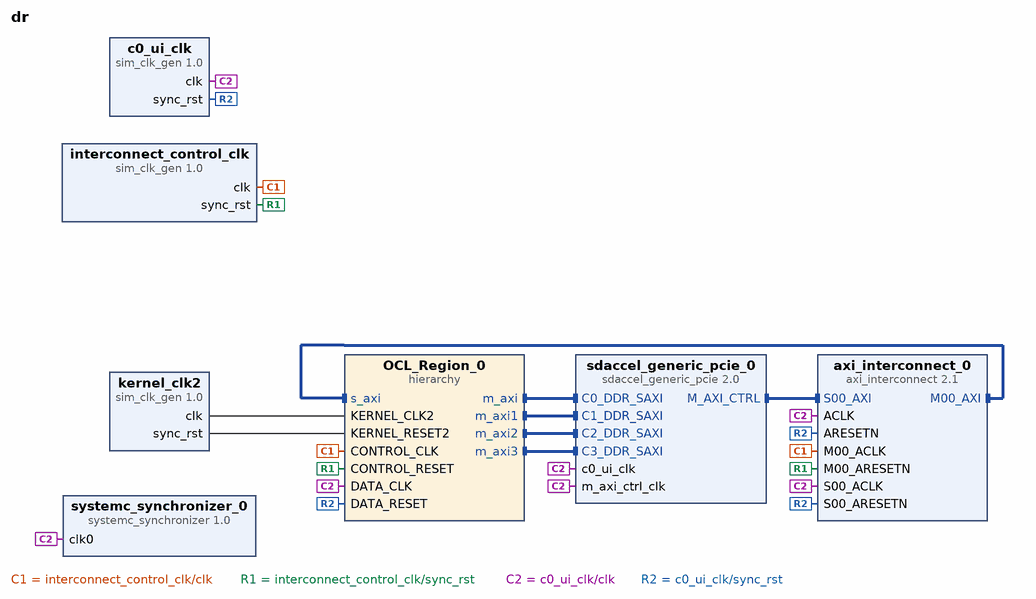
[diagram p0: block diagram of the top level]
# Vivado block design dr, xcvu9p-flgb2104-2-i, Vivado 2017.1_sdxop
create_bd_design dr

create_bd_cell -type hier OCL_Region_0
create_bd_cell -type ip -vlnv xilinx.com:ip:sdaccel_generic_pcie:2.0 sdaccel_generic_pcie_0
set_property -dict [list \
  CONFIG.NUM_SLAVE_SLOTS 4 \
  CONFIG.ADDR_RANGES 1 \
  CONFIG.S0_ADDR_WIDTH 36 \
  CONFIG.S0_DATA_WIDTH 512 \
  CONFIG.S1_ADDR_WIDTH 36 \
  CONFIG.S1_DATA_WIDTH 512 \
  CONFIG.S2_ADDR_WIDTH 36 \
  CONFIG.S2_DATA_WIDTH 512 \
  CONFIG.S3_ADDR_WIDTH 36 \
  CONFIG.S3_DATA_WIDTH 512 \
  CONFIG.C0.NAME mem0 \
  CONFIG.C0.TYPE ddr4 \
  CONFIG.C0.SIZE 16GB \
  CONFIG.C0.A00_BASE_ADDR 0x0000000000000000 \
  CONFIG.C0.A00_HIGH_ADDR 0x0000000400000000 \
  CONFIG.C1.NAME mem1 \
  CONFIG.C1.TYPE ddr4 \
  CONFIG.C1.SIZE 16GB \
  CONFIG.C1.A00_BASE_ADDR 0x0000000400000000 \
  CONFIG.C1.A00_HIGH_ADDR 0x0000000400000000 \
  CONFIG.C2.NAME mem2 \
  CONFIG.C2.TYPE ddr4 \
  CONFIG.C2.SIZE 16GB \
  CONFIG.C2.A00_BASE_ADDR 0x0000000800000000 \
  CONFIG.C2.A00_HIGH_ADDR 0x0000000400000000 \
  CONFIG.NUMBER_OF_GLOBAL_MEMORIES 4 \
  CONFIG.C3.NAME mem3 \
  CONFIG.C3.TYPE ddr4 \
  CONFIG.C3.SIZE 16GB \
  CONFIG.C3.A00_BASE_ADDR 0x0000000C00000000 \
  CONFIG.C3.A00_HIGH_ADDR 0x0000000400000000 \
] [get_bd_cells sdaccel_generic_pcie_0]
create_bd_cell -type ip -vlnv xilinx.com:ip:systemc_synchronizer:1.0 systemc_synchronizer_0
set_property -dict {CONFIG.NUM_OF_CLOCKS 1} [get_bd_cells systemc_synchronizer_0]
create_bd_cell -type ip -vlnv xilinx.com:ip:sim_clk_gen:1.0 c0_ui_clk
set_property -dict {CONFIG.INITIAL_RESET_CLOCK_CYCLES 5 CONFIG.FREQ_HZ 250000000} [get_bd_cells c0_ui_clk]
create_bd_cell -type ip -vlnv xilinx.com:ip:sim_clk_gen:1.0 interconnect_control_clk
set_property -dict {CONFIG.INITIAL_RESET_CLOCK_CYCLES 5 CONFIG.FREQ_HZ 125000000} [get_bd_cells interconnect_control_clk]
create_bd_cell -type ip -vlnv xilinx.com:ip:axi_interconnect:2.1 axi_interconnect_0
set_property -dict {CONFIG.NUM_MI 1} [get_bd_cells axi_interconnect_0]
create_bd_cell -type ip -vlnv xilinx.com:ip:sim_clk_gen:1.0 kernel_clk2
set_property -dict {CONFIG.INITIAL_RESET_CLOCK_CYCLES 5 CONFIG.FREQ_HZ 500000000} [get_bd_cells kernel_clk2]

# ---- hierarchy /OCL_Region_0 ----
current_bd_instance /OCL_Region_0
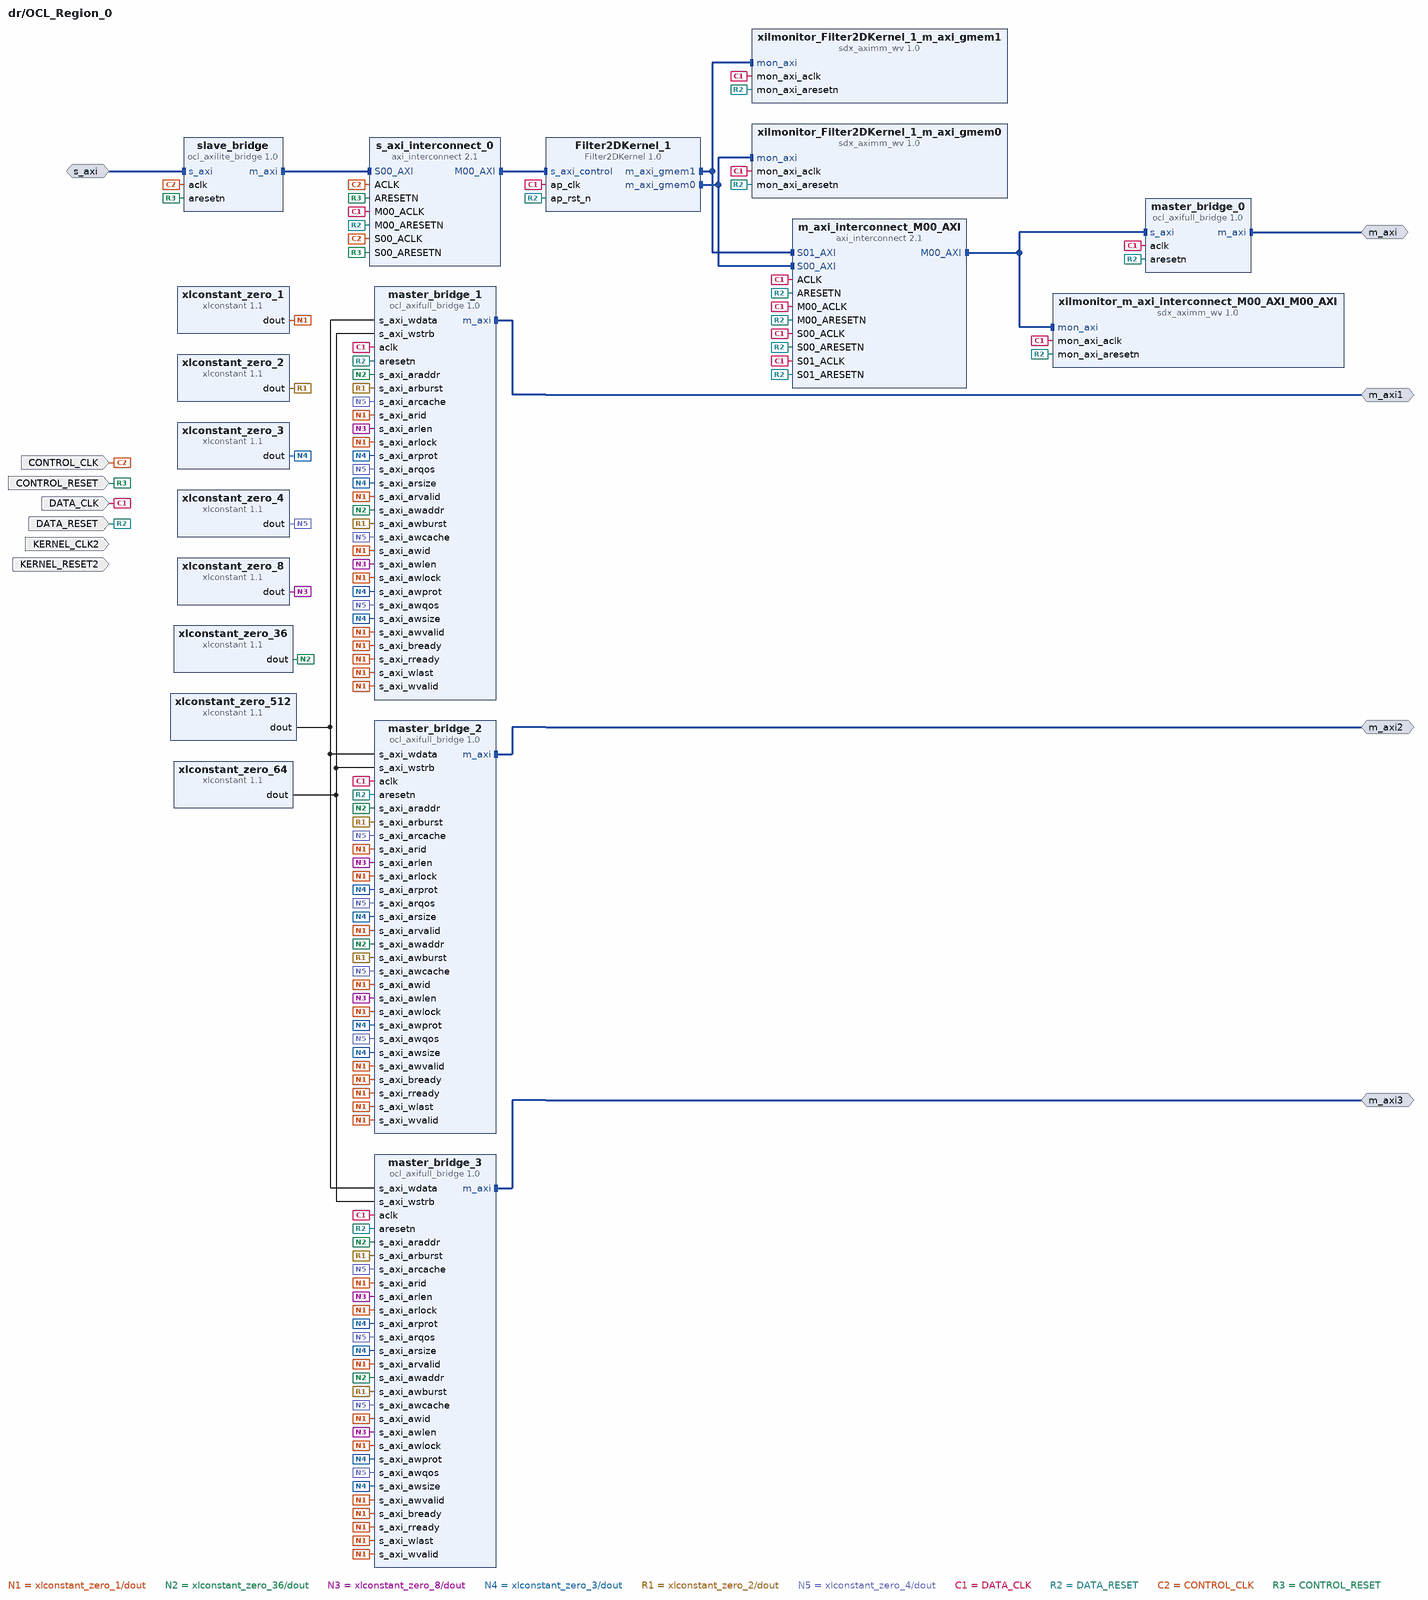
[diagram p1: block diagram inside /OCL_Region_0]
create_bd_intf_pin -mode Master -vlnv xilinx.com:interface:aximm_rtl:1.0 m_axi
create_bd_intf_pin -mode Master -vlnv xilinx.com:interface:aximm_rtl:1.0 m_axi1
create_bd_intf_pin -mode Master -vlnv xilinx.com:interface:aximm_rtl:1.0 m_axi2
create_bd_intf_pin -mode Master -vlnv xilinx.com:interface:aximm_rtl:1.0 m_axi3
create_bd_intf_pin -mode Slave -vlnv xilinx.com:interface:aximm_rtl:1.0 s_axi
create_bd_pin -dir I -type clk DATA_CLK
create_bd_pin -dir I -type rst DATA_RESET
create_bd_pin -dir I -type clk CONTROL_CLK
create_bd_pin -dir I -type rst CONTROL_RESET
create_bd_pin -dir I -type clk KERNEL_CLK2
create_bd_pin -dir I -type rst KERNEL_RESET2

create_bd_cell -type ip -vlnv xilinx.com:hls:Filter2DKernel:1.0 Filter2DKernel_1
create_bd_cell -type ip -vlnv xilinx.com:ip:axi_interconnect:2.1 m_axi_interconnect_M00_AXI
set_property -dict [list \
  CONFIG.NUM_SI 2 \
  CONFIG.NUM_MI 1 \
  CONFIG.XBAR_DATA_WIDTH 512 \
  CONFIG.S00_HAS_REGSLICE 4 \
  CONFIG.S01_HAS_REGSLICE 4 \
] [get_bd_cells m_axi_interconnect_M00_AXI]
create_bd_cell -type ip -vlnv xilinx.com:ip:ocl_axifull_bridge:1.0 master_bridge_0
set_property -dict [list \
  CONFIG.DATA_WIDTH 512 \
  CONFIG.S_ID_WIDTH 2 \
  CONFIG.M_ID_WIDTH 5 \
  CONFIG.ADDR_WIDTH 36 \
  CONFIG.HAS_SLAVE_ID true \
  CONFIG.HAS_BURST 0 \
] [get_bd_cells master_bridge_0]
create_bd_cell -type ip -vlnv xilinx.com:ip:ocl_axifull_bridge:1.0 master_bridge_1
set_property -dict [list \
  CONFIG.DATA_WIDTH 512 \
  CONFIG.S_ID_WIDTH 1 \
  CONFIG.M_ID_WIDTH 4 \
  CONFIG.ADDR_WIDTH 36 \
  CONFIG.HAS_SLAVE_ID true \
  CONFIG.HAS_BURST 0 \
] [get_bd_cells master_bridge_1]
create_bd_cell -type ip -vlnv xilinx.com:ip:ocl_axifull_bridge:1.0 master_bridge_2
set_property -dict [list \
  CONFIG.DATA_WIDTH 512 \
  CONFIG.S_ID_WIDTH 1 \
  CONFIG.M_ID_WIDTH 4 \
  CONFIG.ADDR_WIDTH 36 \
  CONFIG.HAS_SLAVE_ID true \
  CONFIG.HAS_BURST 0 \
] [get_bd_cells master_bridge_2]
create_bd_cell -type ip -vlnv xilinx.com:ip:ocl_axifull_bridge:1.0 master_bridge_3
set_property -dict [list \
  CONFIG.DATA_WIDTH 512 \
  CONFIG.S_ID_WIDTH 1 \
  CONFIG.M_ID_WIDTH 4 \
  CONFIG.ADDR_WIDTH 36 \
  CONFIG.HAS_SLAVE_ID true \
  CONFIG.HAS_BURST 0 \
] [get_bd_cells master_bridge_3]
create_bd_cell -type ip -vlnv xilinx.com:ip:axi_interconnect:2.1 s_axi_interconnect_0
set_property -dict [list \
  CONFIG.NUM_SI 1 \
  CONFIG.NUM_MI 1 \
  CONFIG.XBAR_DATA_WIDTH 32 \
  CONFIG.M00_HAS_REGSLICE 4 \
] [get_bd_cells s_axi_interconnect_0]
create_bd_cell -type ip -vlnv xilinx.com:ip:ocl_axilite_bridge:1.0 slave_bridge
set_property -dict {CONFIG.DATA_WIDTH 32 CONFIG.ADDR_WIDTH 17 CONFIG.HAS_BURST 0} [get_bd_cells slave_bridge]
create_bd_cell -type ip -vlnv xilinx.com:ip:sdx_aximm_wv:1.0 xilmonitor_Filter2DKernel_1_m_axi_gmem0
create_bd_cell -type ip -vlnv xilinx.com:ip:sdx_aximm_wv:1.0 xilmonitor_Filter2DKernel_1_m_axi_gmem1
create_bd_cell -type ip -vlnv xilinx.com:ip:sdx_aximm_wv:1.0 xilmonitor_m_axi_interconnect_M00_AXI_M00_AXI
create_bd_cell -type ip -vlnv xilinx.com:ip:xlconstant:1.1 xlconstant_zero_1
set_property -dict {CONFIG.CONST_WIDTH 1 CONFIG.CONST_VAL 0} [get_bd_cells xlconstant_zero_1]
create_bd_cell -type ip -vlnv xilinx.com:ip:xlconstant:1.1 xlconstant_zero_2
set_property -dict {CONFIG.CONST_WIDTH 2 CONFIG.CONST_VAL 0} [get_bd_cells xlconstant_zero_2]
create_bd_cell -type ip -vlnv xilinx.com:ip:xlconstant:1.1 xlconstant_zero_3
set_property -dict {CONFIG.CONST_WIDTH 3 CONFIG.CONST_VAL 0} [get_bd_cells xlconstant_zero_3]
create_bd_cell -type ip -vlnv xilinx.com:ip:xlconstant:1.1 xlconstant_zero_36
set_property -dict {CONFIG.CONST_WIDTH 36 CONFIG.CONST_VAL 0} [get_bd_cells xlconstant_zero_36]
create_bd_cell -type ip -vlnv xilinx.com:ip:xlconstant:1.1 xlconstant_zero_4
set_property -dict {CONFIG.CONST_WIDTH 4 CONFIG.CONST_VAL 0} [get_bd_cells xlconstant_zero_4]
create_bd_cell -type ip -vlnv xilinx.com:ip:xlconstant:1.1 xlconstant_zero_512
set_property -dict {CONFIG.CONST_WIDTH 512 CONFIG.CONST_VAL 0} [get_bd_cells xlconstant_zero_512]
create_bd_cell -type ip -vlnv xilinx.com:ip:xlconstant:1.1 xlconstant_zero_64
set_property -dict {CONFIG.CONST_WIDTH 64 CONFIG.CONST_VAL 0} [get_bd_cells xlconstant_zero_64]
create_bd_cell -type ip -vlnv xilinx.com:ip:xlconstant:1.1 xlconstant_zero_8
set_property -dict {CONFIG.CONST_WIDTH 8 CONFIG.CONST_VAL 0} [get_bd_cells xlconstant_zero_8]

# ---- connections ----

current_bd_instance /OCL_Region_0
connect_bd_intf_net [get_bd_intf_pins s_axi_interconnect_0/M00_AXI] [get_bd_intf_pins Filter2DKernel_1/s_axi_control]
connect_bd_intf_net [get_bd_intf_pins Filter2DKernel_1/m_axi_gmem1] [get_bd_intf_pins m_axi_interconnect_M00_AXI/S01_AXI]
connect_bd_intf_net [get_bd_intf_pins Filter2DKernel_1/m_axi_gmem1] [get_bd_intf_pins xilmonitor_Filter2DKernel_1_m_axi_gmem1/mon_axi]
connect_bd_intf_net [get_bd_intf_pins Filter2DKernel_1/m_axi_gmem0] [get_bd_intf_pins m_axi_interconnect_M00_AXI/S00_AXI]
connect_bd_intf_net [get_bd_intf_pins Filter2DKernel_1/m_axi_gmem0] [get_bd_intf_pins xilmonitor_Filter2DKernel_1_m_axi_gmem0/mon_axi]
connect_bd_intf_net [get_bd_intf_pins m_axi_interconnect_M00_AXI/M00_AXI] [get_bd_intf_pins master_bridge_0/s_axi]
connect_bd_intf_net [get_bd_intf_pins m_axi_interconnect_M00_AXI/M00_AXI] [get_bd_intf_pins xilmonitor_m_axi_interconnect_M00_AXI_M00_AXI/mon_axi]
connect_bd_intf_net [get_bd_intf_pins slave_bridge/m_axi] [get_bd_intf_pins s_axi_interconnect_0/S00_AXI]
connect_bd_intf_net -intf_net M00_AXI [get_bd_intf_pins m_axi] [get_bd_intf_pins master_bridge_0/m_axi]
connect_bd_intf_net -intf_net M01_AXI [get_bd_intf_pins m_axi1] [get_bd_intf_pins master_bridge_1/m_axi]
connect_bd_intf_net -intf_net M02_AXI [get_bd_intf_pins m_axi2] [get_bd_intf_pins master_bridge_2/m_axi]
connect_bd_intf_net -intf_net M03_AXI [get_bd_intf_pins m_axi3] [get_bd_intf_pins master_bridge_3/m_axi]
connect_bd_intf_net [get_bd_intf_pins s_axi] [get_bd_intf_pins slave_bridge/s_axi]
connect_bd_net [get_bd_pins xlconstant_zero_1/dout] \
  [get_bd_pins master_bridge_1/s_axi_awid] [get_bd_pins master_bridge_1/s_axi_awlock] \
  [get_bd_pins master_bridge_1/s_axi_awvalid] [get_bd_pins master_bridge_1/s_axi_wlast] \
  [get_bd_pins master_bridge_1/s_axi_wvalid] [get_bd_pins master_bridge_1/s_axi_bready] \
  [get_bd_pins master_bridge_1/s_axi_arid] [get_bd_pins master_bridge_1/s_axi_arlock] \
  [get_bd_pins master_bridge_1/s_axi_arvalid] [get_bd_pins master_bridge_1/s_axi_rready] \
  [get_bd_pins master_bridge_2/s_axi_awid] [get_bd_pins master_bridge_2/s_axi_awlock] \
  [get_bd_pins master_bridge_2/s_axi_awvalid] [get_bd_pins master_bridge_2/s_axi_wlast] \
  [get_bd_pins master_bridge_2/s_axi_wvalid] [get_bd_pins master_bridge_2/s_axi_bready] \
  [get_bd_pins master_bridge_2/s_axi_arid] [get_bd_pins master_bridge_2/s_axi_arlock] \
  [get_bd_pins master_bridge_2/s_axi_arvalid] [get_bd_pins master_bridge_2/s_axi_rready] \
  [get_bd_pins master_bridge_3/s_axi_awid] [get_bd_pins master_bridge_3/s_axi_awlock] \
  [get_bd_pins master_bridge_3/s_axi_awvalid] [get_bd_pins master_bridge_3/s_axi_wlast] \
  [get_bd_pins master_bridge_3/s_axi_wvalid] [get_bd_pins master_bridge_3/s_axi_bready] \
  [get_bd_pins master_bridge_3/s_axi_arid] [get_bd_pins master_bridge_3/s_axi_arlock] \
  [get_bd_pins master_bridge_3/s_axi_arvalid] [get_bd_pins master_bridge_3/s_axi_rready]
connect_bd_net [get_bd_pins xlconstant_zero_36/dout] \
  [get_bd_pins master_bridge_1/s_axi_awaddr] [get_bd_pins master_bridge_1/s_axi_araddr] \
  [get_bd_pins master_bridge_2/s_axi_awaddr] [get_bd_pins master_bridge_2/s_axi_araddr] \
  [get_bd_pins master_bridge_3/s_axi_awaddr] [get_bd_pins master_bridge_3/s_axi_araddr]
connect_bd_net [get_bd_pins xlconstant_zero_8/dout] \
  [get_bd_pins master_bridge_1/s_axi_awlen] [get_bd_pins master_bridge_1/s_axi_arlen] \
  [get_bd_pins master_bridge_2/s_axi_awlen] [get_bd_pins master_bridge_2/s_axi_arlen] \
  [get_bd_pins master_bridge_3/s_axi_awlen] [get_bd_pins master_bridge_3/s_axi_arlen]
connect_bd_net [get_bd_pins xlconstant_zero_3/dout] \
  [get_bd_pins master_bridge_1/s_axi_awsize] [get_bd_pins master_bridge_1/s_axi_awprot] \
  [get_bd_pins master_bridge_1/s_axi_arsize] [get_bd_pins master_bridge_1/s_axi_arprot] \
  [get_bd_pins master_bridge_2/s_axi_awsize] [get_bd_pins master_bridge_2/s_axi_awprot] \
  [get_bd_pins master_bridge_2/s_axi_arsize] [get_bd_pins master_bridge_2/s_axi_arprot] \
  [get_bd_pins master_bridge_3/s_axi_awsize] [get_bd_pins master_bridge_3/s_axi_awprot] \
  [get_bd_pins master_bridge_3/s_axi_arsize] [get_bd_pins master_bridge_3/s_axi_arprot]
connect_bd_net [get_bd_pins xlconstant_zero_2/dout] \
  [get_bd_pins master_bridge_1/s_axi_awburst] [get_bd_pins master_bridge_1/s_axi_arburst] \
  [get_bd_pins master_bridge_2/s_axi_awburst] [get_bd_pins master_bridge_2/s_axi_arburst] \
  [get_bd_pins master_bridge_3/s_axi_awburst] [get_bd_pins master_bridge_3/s_axi_arburst]
connect_bd_net [get_bd_pins xlconstant_zero_4/dout] \
  [get_bd_pins master_bridge_1/s_axi_awcache] [get_bd_pins master_bridge_1/s_axi_awqos] \
  [get_bd_pins master_bridge_1/s_axi_arcache] [get_bd_pins master_bridge_1/s_axi_arqos] \
  [get_bd_pins master_bridge_2/s_axi_awcache] [get_bd_pins master_bridge_2/s_axi_awqos] \
  [get_bd_pins master_bridge_2/s_axi_arcache] [get_bd_pins master_bridge_2/s_axi_arqos] \
  [get_bd_pins master_bridge_3/s_axi_awcache] [get_bd_pins master_bridge_3/s_axi_awqos] \
  [get_bd_pins master_bridge_3/s_axi_arcache] [get_bd_pins master_bridge_3/s_axi_arqos]
connect_bd_net [get_bd_pins xlconstant_zero_512/dout] \
  [get_bd_pins master_bridge_1/s_axi_wdata] [get_bd_pins master_bridge_2/s_axi_wdata] \
  [get_bd_pins master_bridge_3/s_axi_wdata]
connect_bd_net [get_bd_pins xlconstant_zero_64/dout] \
  [get_bd_pins master_bridge_1/s_axi_wstrb] [get_bd_pins master_bridge_2/s_axi_wstrb] \
  [get_bd_pins master_bridge_3/s_axi_wstrb]
connect_bd_net [get_bd_pins DATA_CLK] \
  [get_bd_pins s_axi_interconnect_0/M00_ACLK] [get_bd_pins m_axi_interconnect_M00_AXI/M00_ACLK] \
  [get_bd_pins m_axi_interconnect_M00_AXI/ACLK] [get_bd_pins m_axi_interconnect_M00_AXI/S00_ACLK] \
  [get_bd_pins m_axi_interconnect_M00_AXI/S01_ACLK] [get_bd_pins master_bridge_0/aclk] [get_bd_pins master_bridge_1/aclk] \
  [get_bd_pins master_bridge_2/aclk] [get_bd_pins master_bridge_3/aclk] \
  [get_bd_pins xilmonitor_Filter2DKernel_1_m_axi_gmem0/mon_axi_aclk] \
  [get_bd_pins xilmonitor_Filter2DKernel_1_m_axi_gmem1/mon_axi_aclk] \
  [get_bd_pins xilmonitor_m_axi_interconnect_M00_AXI_M00_AXI/mon_axi_aclk] [get_bd_pins Filter2DKernel_1/ap_clk]
connect_bd_net [get_bd_pins DATA_RESET] \
  [get_bd_pins s_axi_interconnect_0/M00_ARESETN] [get_bd_pins m_axi_interconnect_M00_AXI/M00_ARESETN] \
  [get_bd_pins m_axi_interconnect_M00_AXI/ARESETN] [get_bd_pins m_axi_interconnect_M00_AXI/S00_ARESETN] \
  [get_bd_pins m_axi_interconnect_M00_AXI/S01_ARESETN] [get_bd_pins master_bridge_0/aresetn] \
  [get_bd_pins master_bridge_1/aresetn] [get_bd_pins master_bridge_2/aresetn] [get_bd_pins master_bridge_3/aresetn] \
  [get_bd_pins xilmonitor_Filter2DKernel_1_m_axi_gmem0/mon_axi_aresetn] \
  [get_bd_pins xilmonitor_Filter2DKernel_1_m_axi_gmem1/mon_axi_aresetn] \
  [get_bd_pins xilmonitor_m_axi_interconnect_M00_AXI_M00_AXI/mon_axi_aresetn] [get_bd_pins Filter2DKernel_1/ap_rst_n]
connect_bd_net [get_bd_pins CONTROL_CLK] \
  [get_bd_pins s_axi_interconnect_0/S00_ACLK] [get_bd_pins slave_bridge/aclk] [get_bd_pins s_axi_interconnect_0/ACLK]
connect_bd_net [get_bd_pins CONTROL_RESET] \
  [get_bd_pins s_axi_interconnect_0/S00_ARESETN] [get_bd_pins slave_bridge/aresetn] \
  [get_bd_pins s_axi_interconnect_0/ARESETN]

current_bd_instance /
connect_bd_intf_net -intf_net OCL_REGION_0_M00_AXI [get_bd_intf_pins OCL_Region_0/m_axi] [get_bd_intf_pins sdaccel_generic_pcie_0/C0_DDR_SAXI]
connect_bd_intf_net -intf_net OCL_REGION_0_M01_AXI [get_bd_intf_pins OCL_Region_0/m_axi1] [get_bd_intf_pins sdaccel_generic_pcie_0/C1_DDR_SAXI]
connect_bd_intf_net -intf_net OCL_REGION_0_M02_AXI [get_bd_intf_pins OCL_Region_0/m_axi2] [get_bd_intf_pins sdaccel_generic_pcie_0/C2_DDR_SAXI]
connect_bd_intf_net -intf_net OCL_REGION_0_M03_AXI [get_bd_intf_pins OCL_Region_0/m_axi3] [get_bd_intf_pins sdaccel_generic_pcie_0/C3_DDR_SAXI]
connect_bd_intf_net [get_bd_intf_pins axi_interconnect_0/S00_AXI] [get_bd_intf_pins sdaccel_generic_pcie_0/M_AXI_CTRL]
connect_bd_intf_net [get_bd_intf_pins axi_interconnect_0/M00_AXI] [get_bd_intf_pins OCL_Region_0/s_axi]
connect_bd_net [get_bd_pins interconnect_control_clk/clk] [get_bd_pins axi_interconnect_0/M00_ACLK] [get_bd_pins OCL_Region_0/CONTROL_CLK]
connect_bd_net -net interconnect_control_clk_rst [get_bd_pins interconnect_control_clk/sync_rst] \
  [get_bd_pins axi_interconnect_0/M00_ARESETN] [get_bd_pins OCL_Region_0/CONTROL_RESET]
connect_bd_net [get_bd_pins c0_ui_clk/clk] \
  [get_bd_pins sdaccel_generic_pcie_0/c0_ui_clk] [get_bd_pins sdaccel_generic_pcie_0/m_axi_ctrl_clk] \
  [get_bd_pins systemc_synchronizer_0/clk0] [get_bd_pins OCL_Region_0/DATA_CLK] [get_bd_pins axi_interconnect_0/ACLK] \
  [get_bd_pins axi_interconnect_0/S00_ACLK]
connect_bd_net [get_bd_pins c0_ui_clk/sync_rst] \
  [get_bd_pins OCL_Region_0/DATA_RESET] [get_bd_pins axi_interconnect_0/ARESETN] [get_bd_pins axi_interconnect_0/S00_ARESETN]
connect_bd_net [get_bd_pins kernel_clk2/clk] [get_bd_pins OCL_Region_0/KERNEL_CLK2]
connect_bd_net [get_bd_pins kernel_clk2/sync_rst] [get_bd_pins OCL_Region_0/KERNEL_RESET2]

# ---- address map ----
assign_bd_address -offset 0x0000000000000000 -range 16G -target_address_space [get_bd_addr_spaces OCL_Region_0/Filter2DKernel_1/Data_m_axi_gmem0] [get_bd_addr_segs sdaccel_generic_pcie_0/C0_DDR_SAXI/Mem0]
assign_bd_address -offset 0x0000000000000000 -range 16G -target_address_space [get_bd_addr_spaces OCL_Region_0/Filter2DKernel_1/Data_m_axi_gmem1] [get_bd_addr_segs sdaccel_generic_pcie_0/C0_DDR_SAXI/Mem0]
assign_bd_address -offset 0x0000000000000000 -range 4K -target_address_space [get_bd_addr_spaces sdaccel_generic_pcie_0/m_axi_ctrl] [get_bd_addr_segs OCL_Region_0/Filter2DKernel_1/s_axi_control/Reg]

validate_bd_design
save_bd_design
